# Altium schematic sheet RepeatTest.SchDoc
size A
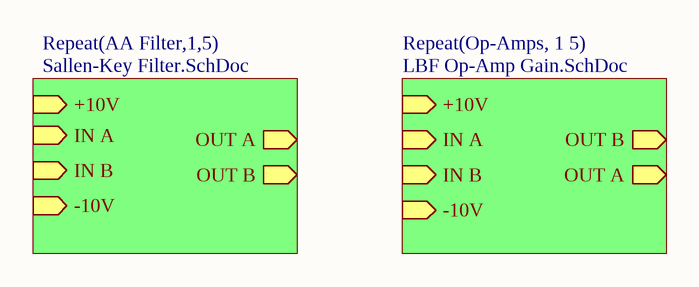
[diagram p0: RepeatTest.SchDoc]

## Sub-sheets
Repeat(AA Filter,1,5) = Sallen-Key Filter.SchDoc: IN A (in), OUT A (out), OUT B (out), IN B (in), +10V (in), -10V (in)
Repeat(Op-Amps, 1 5) = LBF Op-Amp Gain.SchDoc: IN A (in), IN B (in), OUT B (out), OUT A (out), +10V (in), -10V (in)